# Altium schematic sheet Sheet1.SchDoc
size A
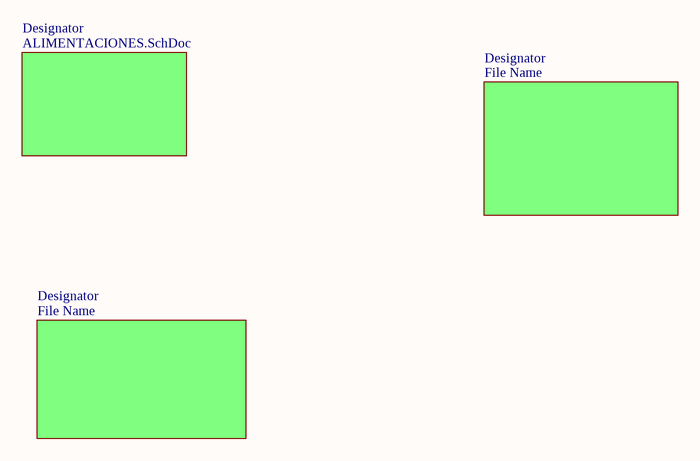
[diagram p0: Sheet1.SchDoc]

## Sub-sheets
Designator = ALIMENTACIONES.SchDoc: no entries
Designator = File Name: no entries
Designator = File Name: no entries